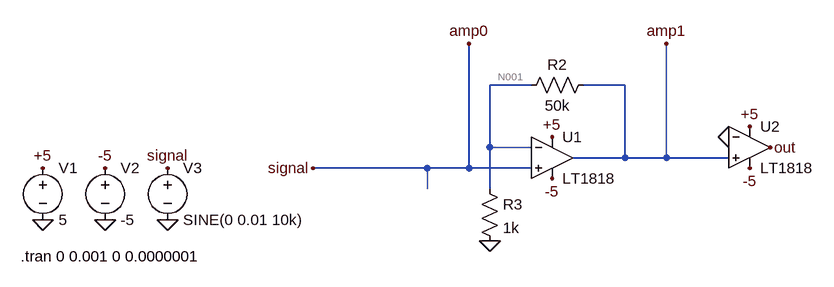
[diagram p0: schematic ac3.asc]
ac3.asc, the LTspice schematic file:
Version 4
SHEET 1 1176 680
WIRE 736 16 672 16
WIRE 880 16 816 16
WIRE 672 112 672 16
WIRE 736 112 672 112
WIRE 880 128 880 16
WIRE 880 128 800 128
WIRE 944 128 944 -48
WIRE 944 128 880 128
WIRE 1040 128 944 128
WIRE 576 144 400 144
WIRE 640 144 640 -48
WIRE 640 144 576 144
WIRE 736 144 640 144
WIRE 576 176 576 144
WIRE 672 176 672 112
FLAG -16 144 +5
FLAG 768 96 +5
FLAG 1072 80 +5
FLAG 768 160 -5
FLAG 1072 144 -5
FLAG 80 144 -5
FLAG 176 144 signal
FLAG 400 144 signal
FLAG 1104 112 out
FLAG -16 224 0
FLAG 80 224 0
FLAG 176 224 0
FLAG 672 256 0
FLAG 1040 96 0
FLAG 944 -48 amp1
FLAG 640 -48 amp0
SYMBOL voltage -16 128 R0
WINDOW 123 0 0 Left 2
WINDOW 39 0 0 Left 2
SYMATTR InstName V1
SYMATTR Value 5
SYMBOL voltage 80 128 R0
WINDOW 123 0 0 Left 2
WINDOW 39 0 0 Left 2
SYMATTR InstName V2
SYMATTR Value -5
SYMBOL voltage 176 128 R0
WINDOW 123 0 0 Left 2
WINDOW 39 0 0 Left 2
SYMATTR InstName V3
SYMATTR Value SINE(0 0.01 10k)
SYMBOL Opamps\\LT1818 768 128 R0
SYMATTR InstName U1
SYMBOL Opamps\\LT1818 1072 112 R0
SYMATTR InstName U2
SYMBOL res 832 0 R90
WINDOW 0 0 56 VBottom 2
WINDOW 3 32 56 VTop 2
SYMATTR InstName R2
SYMATTR Value 50k
SYMBOL res 656 160 R0
SYMATTR InstName R3
SYMATTR Value 1k
TEXT -50 280 Left 2 !.tran 0 0.001 0 0.0000001

The netlist it stands for:
* ac3.asc
V1 +5 0 5
V2 -5 0 -5
V3 amp0 0 SINE(0 0.01 10k)
XU1 amp0 N001 amp1 +5 -5 LT1818  ; pins In+ In- OUT V+ V-
XU2 amp1 0 out +5 -5 LT1818  ; pins In+ In- OUT V+ V-
R2 amp1 N001 50k
R3 N001 0 1k
.tran 0 0.001 0 0.0000001
.lib LTC2.lib
.backanno
.end

* Results of the author's LTspice run, read from the files saved beside the schematic
* Operating Point, zero values left out:
*   V(+5) = 5 V
*   V(-5) = -5 V
*   V(n001) = 45.86 µV
*   V(amp1) = -97.63 mV
*   V(out) = -4.11 V
*   I(R3) = 45.86 nA
*   I(R2) = -1.954 µA
*   I(V3) = 2 µA
*   I(V2) = 18 mA
*   I(V1) = -18 mA
*   Ix(u1:1) = -2 µA
*   Ix(u1:2) = -1.999 µA
*   Ix(u1:3) = 4.093 µA
*   Ix(u1:4) = 8.999 mA
*   Ix(u1:5) = -8.999 mA
*   Ix(u2:1) = -2.139 µA
*   Ix(u2:2) = -1.869 µA
*   Ix(u2:3) = 8.22 pA
*   Ix(u2:4) = 9.001 mA
*   Ix(u2:5) = -8.997 mA
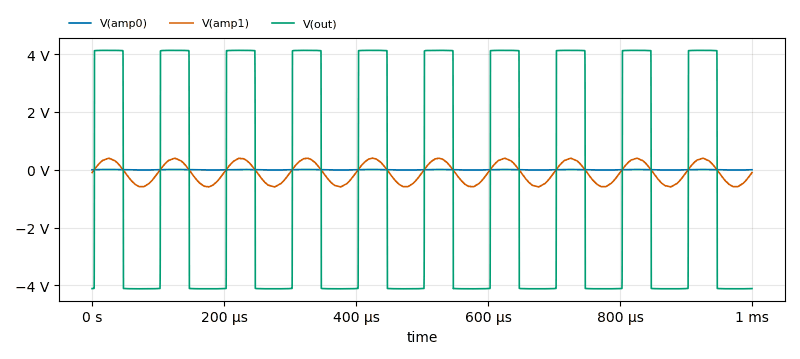
[diagram p1: Transient Analysis of ac3.asc, plotted from the saved traces]
* Transient Analysis, 1 run:
*   V(amp0): min -9.941 mV, max 9.993 mV, average 3.904 µV, rms 6.983 mV, last 0 V
*   V(amp1): min -593.6 mV, max 400.8 mV, average -97.44 mV, rms 361.7 mV, last -98.28 mV
*   V(out): min -4.118 V, max 4.129 V, average -511.2 mV, rms 4.108 V, last -4.11 V